# EAGLE design ZX_Kempston (EAGLE 6.5.0)
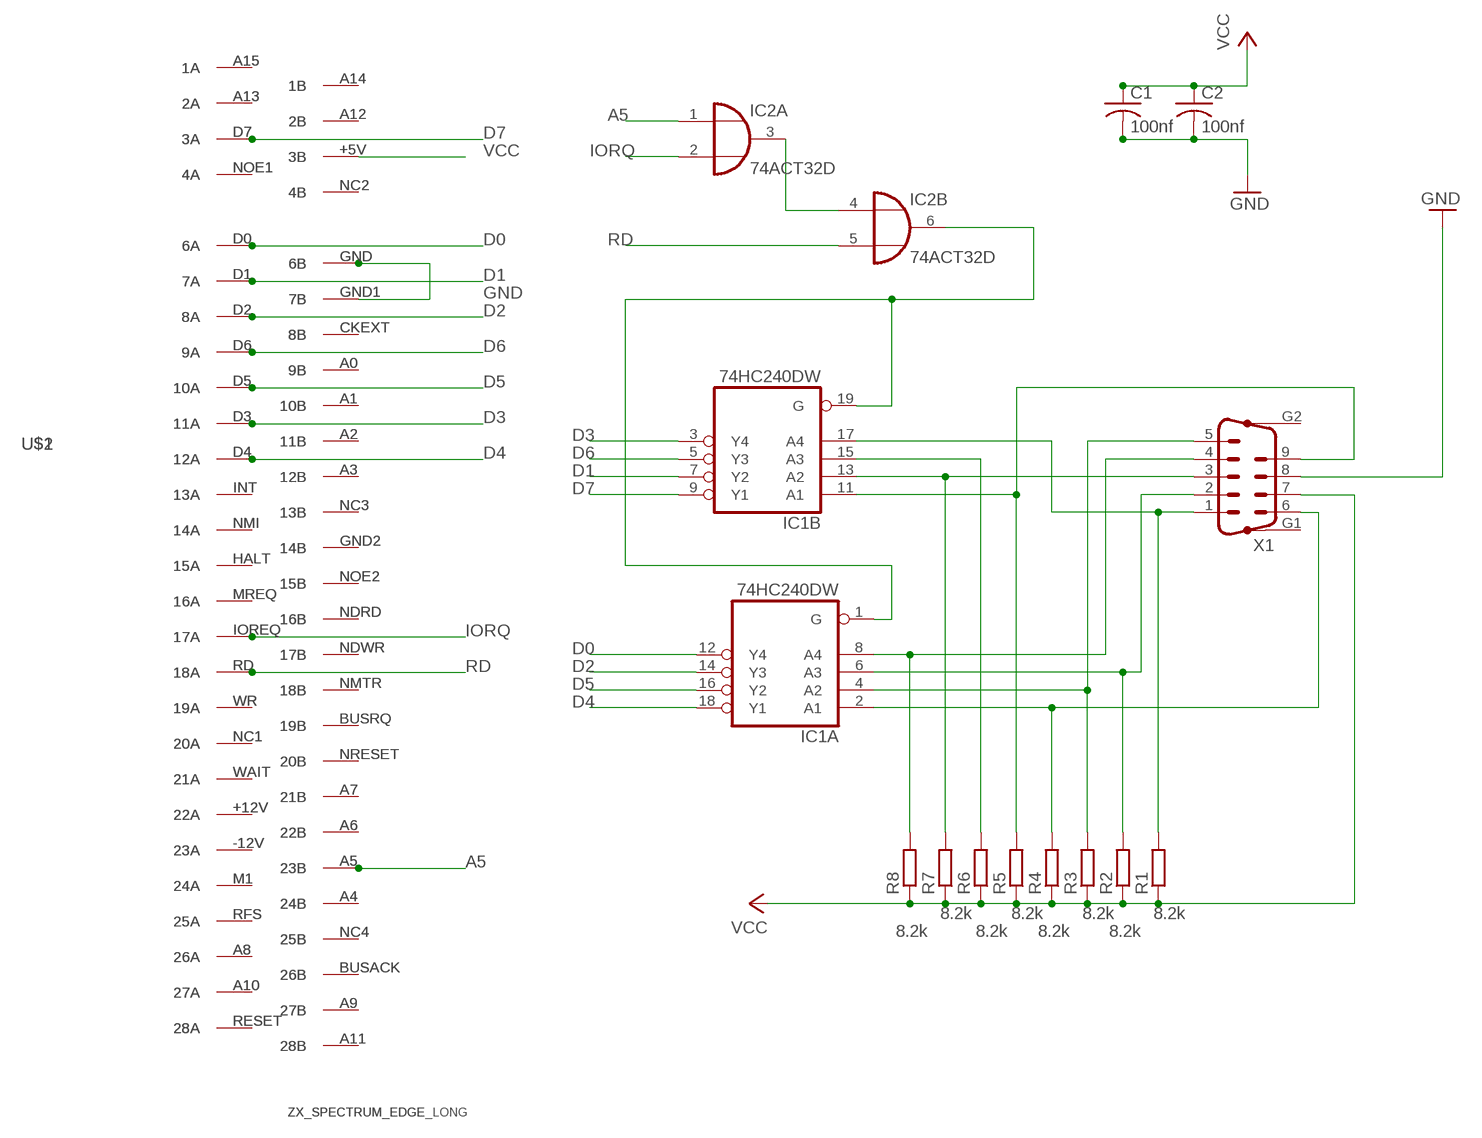
[diagram p0: schematic, sheet 1]

## Parts
C1  100nf  C-USC0805  [C0805]
C2  100nf  C-USC0805  [C0805]
IC1  74HC240DW  [SO20W]
IC2  74ACT32D  [SO14]
R1  8.2k  R-EU_M0805  [M0805]
R2  8.2k  R-EU_M0805  [M0805]
R3  8.2k  R-EU_M0805  [M0805]
R4  8.2k  R-EU_M0805  [M0805]
R5  8.2k  R-EU_M0805  [M0805]
R6  8.2k  R-EU_M0805  [M0805]
R7  8.2k  R-EU_M0805  [M0805]
R8  8.2k  R-EU_M0805  [M0805]
U$1  ZX_SPECTRUM_EDGE  [2X28_EDGE_2.54]
U$2  ZX_SPECTRUM_EDGE_LONG  [2X28_EDGE_LONG]
X1  M09VP  [M09VP]

## Nets
A5: IC2.1(A:I0) U$1.A5(23B) U$2.A5(23B)
D0: IC1.12(A:Y4) U$1.D0(6A) U$2.D0(6A)
D1: IC1.7(B:Y2) U$1.D1(7A) U$2.D1(7A)
D2: IC1.14(A:Y3) U$1.D2(8A) U$2.D2(8A)
D3: IC1.3(B:Y4) U$1.D3(11A) U$2.D3(11A)
D4: IC1.18(A:Y1) U$1.D4(12A) U$2.D4(12A)
D5: IC1.16(A:Y2) U$1.D5(10A) U$2.D5(10A)
D6: IC1.5(B:Y3) U$1.D6(9A) U$2.D6(9A)
D7: IC1.9(B:Y1) U$1.D7(3A) U$2.D7(3A)
GND [GND]: C1.2 C2.2 U$1.GND1(7B) U$1.GND(6B) U$2.GND1(7B) U$2.GND(6B) X1.8
IORQ: IC2.2(A:I1) U$1.IOREQ(17A) U$2.IOREQ(17A)
N$1: U$1.RESET(28A) U$2.RESET(28A)
N$2: U$1.A9(27B) U$2.A9(27B)
N$3: U$1.A10(27A) U$2.A10(27A)
N$4: U$1.BUSACK(26B) U$2.BUSACK(26B)
N$5: U$1.A8(26A) U$2.A8(26A)
N$6: U$1.NC4(25B) U$2.NC4(25B)
N$7: U$1.RFS(25A) U$2.RFS(25A)
N$8: U$1.A4(24B) U$2.A4(24B)
N$9: U$1.M1(24A) U$2.M1(24A)
N$11: U$1.-12V(23A) U$2.-12V(23A)
N$12: U$1.A6(22B) U$2.A6(22B)
N$13: U$1.+12V(22A) U$2.+12V(22A)
N$14: U$1.A7(21B) U$2.A7(21B)
N$15: U$1.WAIT(21A) U$2.WAIT(21A)
N$16: U$1.NRESET(20B) U$2.NRESET(20B)
N$17: U$1.NC1(20A) U$2.NC1(20A)
N$18: U$1.BUSRQ(19B) U$2.BUSRQ(19B)
N$19: U$1.WR(19A) U$2.WR(19A)
N$20: U$1.NMTR(18B) U$2.NMTR(18B)
N$22: U$1.NDWR(17B) U$2.NDWR(17B)
N$24: U$1.NDRD(16B) U$2.NDRD(16B)
N$25: U$1.MREQ(16A) U$2.MREQ(16A)
N$26: U$1.NOE2(15B) U$2.NOE2(15B)
N$27: U$1.HALT(15A) U$2.HALT(15A)
N$28: U$1.GND2(14B) U$2.GND2(14B)
N$29: U$1.NMI(14A) U$2.NMI(14A)
N$30: U$1.NC3(13B) U$2.NC3(13B)
N$31: U$1.INT(13A) U$2.INT(13A)
N$32: U$1.A3(12B) U$2.A3(12B)
N$34: U$1.A2(11B) U$2.A2(11B)
N$36: U$1.A1(10B) U$2.A1(10B)
N$38: U$1.A0(9B) U$2.A0(9B)
N$40: U$1.CKEXT(8B) U$2.CKEXT(8B)
N$46: U$1.NC2(4B) U$2.NC2(4B)
N$47: U$1.NOE1(4A) U$2.NOE1(4A)
N$50: U$1.A12(2B) U$2.A12(2B)
N$51: U$1.A13(2A) U$2.A13(2A)
N$52: U$1.A14(1B) U$2.A14(1B)
N$53: U$1.A15(1A) U$2.A15(1A)
N$54: U$1.A11(28B) U$2.A11(28B)
N$55: IC1.17(B:A4) R1.2 X1.1
N$56: IC1.6(A:A3) R2.2 X1.2
N$57: IC1.1(A:G) IC1.19(B:G) IC2.6(B:O)
N$58: IC2.3(A:O) IC2.4(B:I0)
N$59: IC1.13(B:A2) R7.2 X1.3
N$60: IC1.8(A:A4) R8.2 X1.4
N$61: IC1.4(A:A2) R3.2 X1.5
N$62: IC1.2(A:A1) R4.2 X1.6
N$64: IC1.15(B:A3) R6.2
N$65: IC1.11(B:A1) R5.2 X1.9
RD: IC2.5(B:I1) U$1.RD(18A) U$2.RD(18A)
VCC [VCC]: C1.1 C2.1 R1.1 R2.1 R3.1 R4.1 R5.1 R6.1 R7.1 R8.1 U$1.+5V(3B) U$2.+5V(3B) X1.7
Unconnected: IC2.8(C:O) IC2.9(C:I0) IC2.10(C:I1) IC2.11(D:O) IC2.12(D:I0) IC2.13(D:I1) X1.G1 X1.G2

## Power pins joined to a net without a drawn wire
GND: IC1.10(P:GND) IC2.7(P:GND)
VCC: IC1.20(P:VCC) IC2.14(P:VCC)

## Library data of the parts
C1 C2 = adafruit:C-US: CAPACITOR, American symbol
IC1 = 74xx-eu:74*240: Octal BUFFER and LINE DRIVER, 3-state
IC2 = 74xx-eu:74*32: Quad 2-input OR gate
R1-R8 = rcl:R-EU_: RESISTOR, European symbol
U$1 = 8Bit_Parts:ZX_SPECTRUM_EDGE: +2a/+3 edge connector
U$2 = 8Bit_Parts:ZX_SPECTRUM_EDGE_LONG: +2a/+3 edge connector
X1 = con-subd:M09VP: SUB-D; OC_FARNELL: unknown; OC_NEWARK: unknown

## Net classes
1 GND: width 0.457 mm
2 VCC: width 0.457 mm

## Board
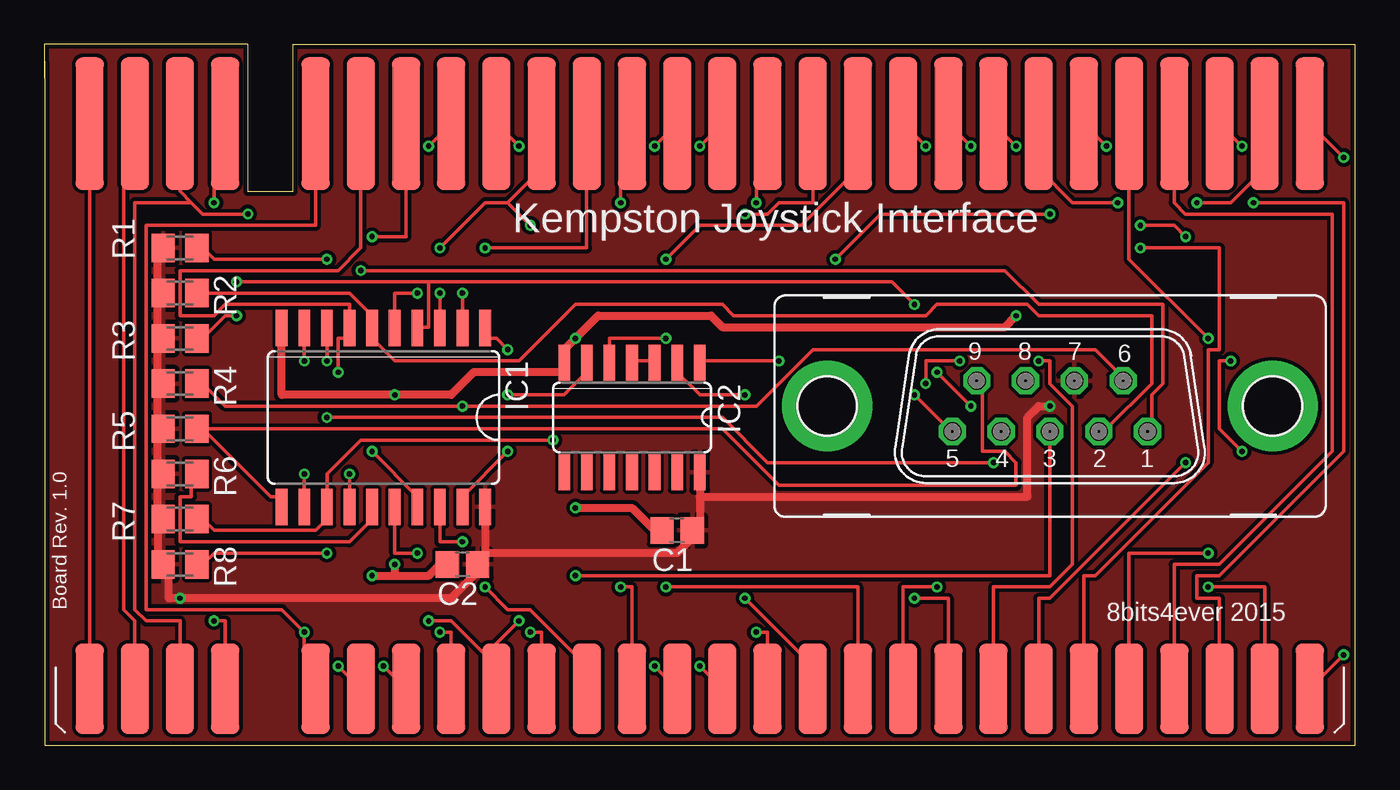
[diagram p1: board, top side]
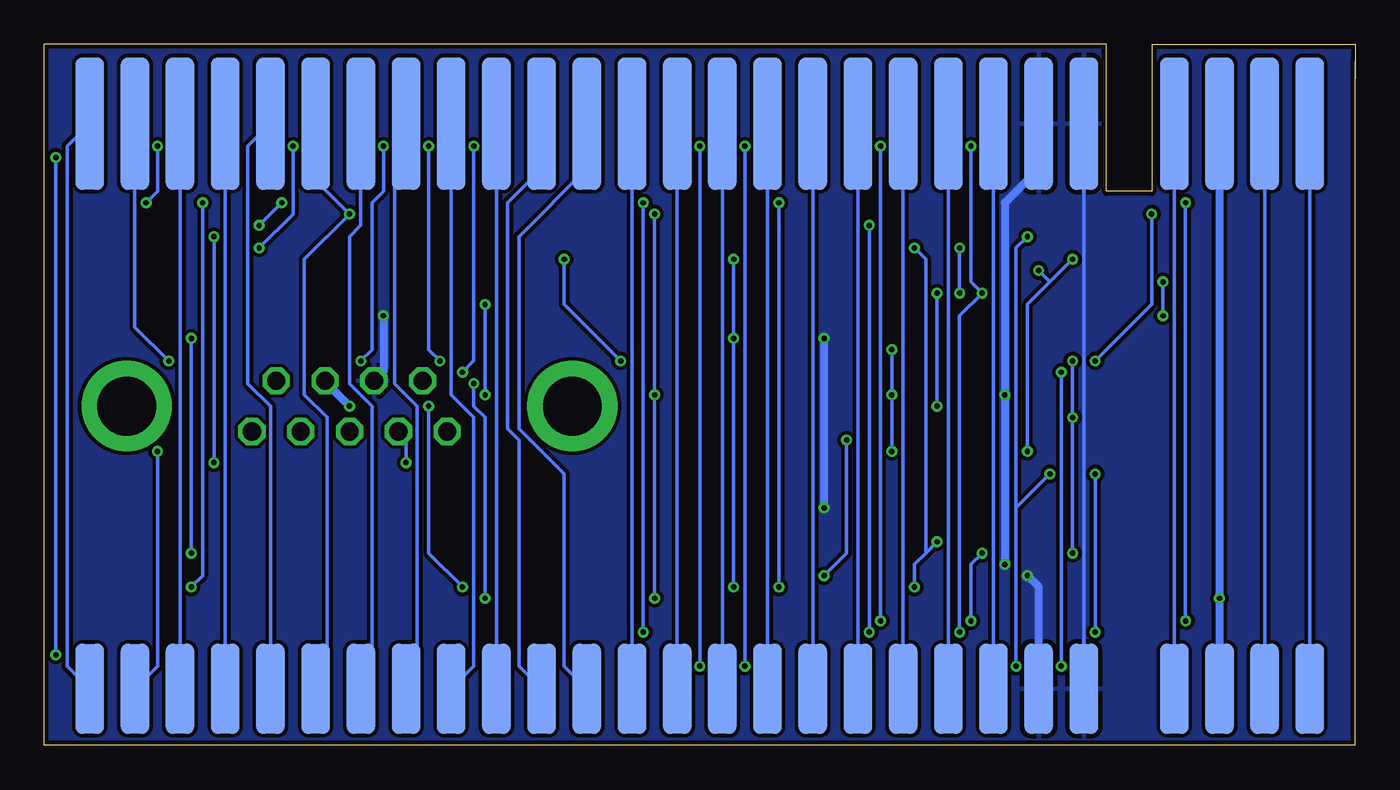
[diagram p2: board, bottom side, seen from below]

Size 73.66 x 39.37 mm. Coordinates in mm from the lower left corner, seen from the top.
Outline: 0.01,38.41 0.01,0 73.66,0 73.66,39.37 13.97,39.37 13.97,31.11 11.43,31.11 11.43,39.37 0,39.37 0,37.46
Copper layers (1*16): Top 0.035mm / dielectric 1.5mm / Bottom 0.035mm
Design rules "SeeedStudio_2layer_DRU_no_angle_20140221 *": minimum track width 8mil, minimum drill 12mil, track to track 8mil, track to pad 6mil, pad to pad 6mil, via to via 6mil, smd to smd 0mil, copper to edge 10mil, drill to drill 10mil, minimum pad ring 10mil, minimum via ring 6mil, stop-mask expansion 2mil, vias tented up to drill 100mil, thermal gap 10mil

### Footprints (pad centres in the part's own frame; a part is rotated, then mirrored left to right if it is on the bottom)
C0805 = smd 1.3 x 1.5: 1 -0.85,0; 2 0.85,0
SO20W = smd 0.66 x 2.032: 1 -5.715,-5.029; 2 -4.445,-5.029; 3 -3.175,-5.029; 4 -1.905,-5.029; 5 -0.635,-5.029; 6 0.635,-5.029; 7 1.905,-5.029; 8 3.175,-5.029; 9 4.445,-5.029; 10 5.715,-5.029; 11 5.715,5.029; 12 4.445,5.029; 13 3.175,5.029; 14 1.905,5.029; 15 0.635,5.029; 16 -0.635,5.029; 17 -1.905,5.029; 18 -3.175,5.029; 19 -4.445,5.029; 20 -5.715,5.029
SO14 = smd 0.66 x 2.032: 1 -3.81,-3.073; 2 -2.54,-3.073; 3 -1.27,-3.073; 4 0,-3.073; 5 1.27,-3.073; 6 2.54,-3.073; 7 3.81,-3.073; 8 3.81,3.073; 9 2.54,3.073; 10 1.27,3.073; 11 0,3.073; 12 -1.27,3.073; 13 -2.54,3.073; 14 -3.81,3.073
M0805 = smd 1.3 x 1.6: 1 -0.95,0; 2 0.95,0
2X28_EDGE_2.54 = smd 1.6 x 5.08 bottom: +5V -29.21,1.27; A0 -13.97,1.27; A1 -11.43,1.27; A2 -8.89,1.27; A3 -6.35,1.27; A4 24.13,1.27; A5 21.59,1.27; A6 19.05,1.27; A7 16.51,1.27; A9 31.75,1.27; A11 34.29,1.27; A12 -31.75,1.27; A14 -34.29,1.27; BUSACK 29.21,1.27; BUSRQ 11.43,1.27; CKEXT -16.51,1.27; GND -21.59,1.27; GND1 -19.05,1.27; GND2 -1.27,1.27; NC2 -26.67,1.27; NC3 -3.81,1.27; NC4 26.67,1.27; NDRD 3.81,1.27; NDWR 6.35,1.27; NMTR 8.89,1.27; NOE2 1.27,1.27; NRESET 13.97,1.27 | smd 1.6 x 5.08: +12V 19.05,1.27; -12V 21.59,1.27; A8 29.21,1.27; A10 31.75,1.27; A13 -31.75,1.27; A15 -34.29,1.27; D0 -21.59,1.27; D1 -19.05,1.27; D2 -16.51,1.27; D3 -8.89,1.27; D4 -6.35,1.27; D5 -11.43,1.27; D6 -13.97,1.27; D7 -29.21,1.27; HALT 1.27,1.27; INT -3.81,1.27; IOREQ 6.35,1.27; M1 24.13,1.27; MREQ 3.81,1.27; NC1 13.97,1.27; NMI -1.27,1.27; NOE1 -26.67,1.27; RD 8.89,1.27; RESET 34.29,1.27; RFS 26.67,1.27; WAIT 16.51,1.27; WR 11.43,1.27
2X28_EDGE_LONG = smd 1.6 x 7.452 bottom: +5V -30.48,0; A0 -15.24,0; A1 -12.7,0; A2 -10.16,0; A3 -7.62,0; A4 22.86,0; A5 20.32,0; A6 17.78,0; A7 15.24,0; A9 30.48,0; A11 33.02,0; A12 -33.02,0; A14 -35.56,0; BUSACK 27.94,0; BUSRQ 10.16,0; CKEXT -17.78,0; GND -22.86,0; GND1 -20.32,0; GND2 -2.54,0; NC2 -27.94,0; NC3 -5.08,0; NC4 25.4,0; NDRD 2.54,0; NDWR 5.08,0; NMTR 7.62,0; NOE2 0,0; NRESET 12.7,0 | smd 1.6 x 7.452: +12V 17.78,0; -12V 20.32,0; A8 27.94,0; A10 30.48,0; A13 -33.02,0; A15 -35.56,0; D0 -22.86,0; D1 -20.32,0; D2 -17.78,0; D3 -10.16,0; D4 -7.62,0; D5 -12.7,0; D6 -15.24,0; D7 -30.48,0; HALT 0,0; INT -5.08,0; IOREQ 5.08,0; M1 22.86,0; MREQ 2.54,0; NC1 12.7,0; NMI -2.54,0; NOE1 -27.94,0; RD 7.62,0; RESET 33.02,0; RFS 25.4,0; WAIT 15.24,0; WR 10.16,0
M09VP = drill 1.016 octagon: 1 -5.486,1.422; 2 -2.743,1.422; 3 0,1.422; 4 2.743,1.422; 5 5.486,1.422; 6 -4.115,-1.422; 7 -1.372,-1.422; 8 1.372,-1.422; 9 4.115,-1.422 | drill 3.302 pad 5.08: G1 -12.522,0; G2 12.522,0

### Placement (x,y rotation side)
C1  35.56,12.06 180 top
C2  23.49,10.16 180 top
IC1  19.05,18.42 180 top
IC2  33.02,18.42 180 top
R1  7.62,27.94 0 top
R2  7.62,25.4 0 top
R3  7.62,22.86 0 top
R4  7.62,20.32 0 top
R5  7.62,17.78 0 top
R6  7.62,15.24 0 top
R7  7.62,12.7 0 top
R8  7.62,10.16 0 top
U$1  36.83,1.9 0 top
U$2  38.1,34.92 0 top
X1  56.52,19.05 180 top

### Tracks (layer width: path | path; a pad name or v marks a point on that pad's centre or on a via)
A5  (via drill 0.3)
  Top 0.203: v41.27,21.59 36.83,21.59 IC2.1 | v44.45,27.3 46.99,29.85 v56.52,29.85
  Bottom 0.203: v41.27,21.59 44.45,24.77 v44.45,27.3 | U$2.A5 58.42,31.75 v56.52,29.85 59.05,27.3 59.05,19.69 57.78,18.42 57.78,3.81 U$1.A5
D0  (via drill 0.3)
  Top 0.203: v14.61,15.24 IC1.12 | U$1.D0 14.61,3.18 v14.61,6.35 13.34,7.62 5.71,7.62 5.71,29.21 15.24,29.21 U$2.D0
  Bottom 0.203: v14.61,6.35 v14.61,15.24
D1  (via drill 0.3)
  Top 0.203: U$2.D1 17.78,27.94 16.51,26.67 7.62,26.67 7.62,24.13 9.53,24.13 10.16,24.77 17.14,24.77 IC1.7 17.14,22.86 16.51,22.86 v16.51,20.96 | v16.51,4.45 U$1.D1
  Bottom 0.203: v16.51,20.96 v16.51,4.45
D2  (via drill 0.3)
  Top 0.203: v17.14,15.24 IC1.14 | U$1.D2 v19.05,4.45 | U$2.D2 20.32,28.57 v18.41,28.57
  Bottom 0.203: 19.05,13.33 v17.14,15.24 | v19.05,4.45 19.05,13.33 | v18.41,28.57 19.05,27.94 19.05,13.33
D3  (via drill 0.3)
  Top 0.203: v22.22,25.4 IC1.3 | v22.22,27.94 24.77,30.48 26.04,30.48 | 26.04,30.48 27.94,32.38 U$2.D3 | U$1.D3 27.94,6.35 v27.3,6.35 | 26.04,30.48 v27.3,29.21
  Bottom 0.203: v22.22,27.94 v22.22,25.4 | v27.3,29.21 v27.3,6.35
D4  (via drill 0.3)
  Top 0.203: IC1.18 22.22,11.43 v23.49,11.43 | v24.77,8.89 26.04,7.62 27.3,7.62 30.48,4.45 U$1.D4 | U$2.D4 30.48,27.94 v24.77,27.94
  Bottom 0.203: 24.13,10.79 24.77,10.16 v24.77,8.89 | 24.13,10.79 v23.49,11.43 | v24.77,27.94 24.13,27.3 24.13,10.79
D5  (via drill 0.3)
  Top 0.203: IC1.16 19.68,10.79 v20.95,10.79 | v21.59,6.98 22.86,6.98 24.77,5.08 | 24.77,5.08 25.4,4.45 U$1.D5 24.77,5.08 | v26.67,33.66 U$2.D5 | 24.77,5.08 v26.67,6.98
  Bottom 0.203: v20.95,10.79 21.59,10.16 v21.59,6.98 | v26.67,6.98 v26.67,33.66
D6  (via drill 0.3)
  Top 0.203: IC1.5 19.68,25.4 v20.95,25.4 | U$2.D6 v21.59,33.66 | U$1.D6 22.86,6.35 v22.22,6.35
  Bottom 0.203: v21.59,33.66 21.59,26.04 v20.95,25.4 22.22,24.13 v22.22,6.35
D7  (via drill 0.3)
  Top 0.203: v14.61,21.59 IC1.9 | v11.43,29.85 8.89,29.85 8.26,30.48 | 8.26,30.48 7.62,31.11 U$2.D7 | U$1.D7 7.62,6.98 5.71,6.98 5.08,7.62 5.08,30.48 8.26,30.48
  Bottom 0.203: v14.61,21.59 11.43,24.77 v11.43,29.85
GND  (via drill 0.3)
  Top 0.457: v18.41,9.53 19.68,9.53 | 19.68,9.53 21.59,9.53 22.22,10.16 C2.2 | v19.68,10.16 19.68,9.53 | v29.84,13.33 33.02,13.33 34.29,12.06 C1.2 | IC1.10 13.34,19.69 v19.68,19.69 22.86,19.69 24.13,20.96 29.21,20.96 IC2.7 29.21,22.23 v29.84,22.86 31.12,24.13 37.46,24.13 38.1,23.5 53.98,23.5 v54.61,24.13
  Bottom 0.203: U$2.GND U$1.GND
  Bottom 0.457: v18.41,9.53 17.78,8.89 U$1.GND1 | v19.68,10.16 v19.68,19.69 19.68,30.48 17.78,32.38 U$2.GND1 | v29.84,22.86 v29.84,13.33 | v54.61,24.13 54.61,20.96 X1.8
  pour Bottom: -1.27,40.64 -1.27,-1.91 75.56,-1.91 75.56,40.64
IORQ  (via drill 0.3)
  Top 0.203: v39.37,19.69 36.83,19.69 35.56,20.96 IC2.2 | v39.37,8.25 43.18,4.45 U$1.IOREQ | U$2.IOREQ 43.18,30.48 41.27,30.48 40.64,29.85 v39.37,29.85
  Bottom 0.203: v39.37,8.25 v39.37,19.69 v39.37,29.85
N$1  (via drill 0.3)
  Top 0.203: v73.03,5.08 U$1.RESET | U$2.RESET v73.03,33.02
  Bottom 0.203: v73.03,33.02 v73.03,5.08
N$2  (via drill 0.3)
  Top 0.203: v67.31,16.51 66.04,17.78 66.04,21.59 v66.67,21.59
  Bottom 0.203: U$1.A9 67.31,4.45 v67.31,16.51 | v66.67,21.59 68.58,23.5 U$2.A9
N$3  (via drill 0.3)
  Top 0.203: U$1.A10 68.58,8.89 v65.41,8.89 | v64.77,30.48 66.67,30.48 68.58,32.38 U$2.A10
  Bottom 0.203: v65.41,8.89 64.77,9.53 v64.77,30.48
N$4
  Bottom 0.203: U$2.BUSACK U$1.BUSACK
N$5  (via drill 0.3)
  Top 0.203: U$1.A8 66.04,8.25 64.77,8.25 64.77,9.53 66.04,9.53 73.03,16.51 73.03,30.48 v67.94,30.48 | U$2.A8 v67.31,33.66
  Bottom 0.203: v67.94,30.48 67.31,31.11 v67.31,33.66
N$6
  Bottom 0.203: U$2.NC4 U$1.NC4
N$7
  Top 0.203: U$1.RFS 63.5,10.16 66.04,10.16 72.39,16.51 72.39,29.85 64.14,29.85 63.5,30.48 U$2.RFS
N$8
  Bottom 0.203: U$1.A4 60.96,19.05 62.23,20.32 62.23,33.66 U$2.A4
N$9  (via drill 0.3)
  Top 0.203: U$1.M1 60.96,10.79 v65.41,10.79 | v65.41,22.86 60.96,27.3 U$2.M1
  Bottom 0.203: v65.41,22.86 v65.41,10.79
N$11  (via drill 0.3)
  Top 0.203: U$1.-12V 58.42,9.53 59.05,9.53 65.41,15.87 65.41,22.23 66.04,22.23 66.04,27.94 v61.59,27.94 | U$2.-12V v59.69,33.66
  Bottom 0.203: v61.59,27.94 59.69,29.85 v59.69,33.66
N$12
  Bottom 0.203: U$1.A6 55.24,3.81 55.24,19.05 56.52,20.32 56.52,28.57 55.88,29.21 U$2.A6
N$13  (via drill 0.3)
  Top 0.203: U$1.+12V 55.88,8.25 56.52,8.25 v64.14,15.87 | v64.14,28.57 63.5,29.21 v61.59,29.21 | v60.32,30.48 57.78,30.48 55.88,32.38 U$2.+12V
  Bottom 0.203: v64.14,28.57 v64.14,15.87 | v60.32,30.48 v61.59,29.21
N$14
  Bottom 0.203: U$1.A7 52.7,3.81 52.7,19.05 53.98,20.32 53.98,34.29 U$2.A7
N$15  (via drill 0.3)
  Top 0.203: U$1.WAIT 53.34,8.89 56.52,8.89 57.78,10.16 57.78,19.05 56.52,20.32 56.52,21.59 v55.88,21.59 | U$2.WAIT v54.61,33.66
  Bottom 0.203: v55.88,21.59 55.24,22.23 55.24,30.48 54.61,31.11 v54.61,33.66
N$16
  Bottom 0.203: U$1.NRESET 49.53,4.45 49.53,18.42 50.8,19.69 U$2.NRESET
N$17  (via drill 0.3)
  Top 0.203: U$1.NC1 50.8,8.25 v48.89,8.25 | v49.53,20.32 49.53,21.59 v51.44,21.59 | U$2.NC1 v52.07,33.66
  Bottom 0.203: v48.89,8.25 48.89,18.42 49.53,19.05 v49.53,20.32 | v51.44,21.59 52.07,22.23 v52.07,33.66
N$18
  Bottom 0.203: U$2.BUSRQ U$1.BUSRQ
N$19  (via drill 0.3)
  Top 0.203: U$1.WR 48.26,8.89 v50.16,8.89 | v50.16,20.96 v52.07,19.05 | U$2.WR v49.53,33.66
  Bottom 0.203: v50.16,8.89 52.07,10.79 v52.07,19.05 | v50.16,20.96 49.53,21.59 v49.53,33.66
N$20
  Bottom 0.203: U$1.NMTR 46.99,4.45 46.99,17.14 47.62,17.78 47.62,30.48 45.72,32.38 U$2.NMTR
N$22
  Bottom 0.203: U$1.NDWR 44.45,4.45 44.45,15.24 46.99,17.78 46.99,28.57 43.18,32.38 U$2.NDWR
N$24
  Bottom 0.203: U$2.NDRD U$1.NDRD
N$25  (via drill 0.3)
  Top 0.203: U$1.MREQ 40.64,6.35 v40,6.35 | v40,30.48 40,34.92 U$2.MREQ
  Bottom 0.203: v40,30.48 v40,6.35
N$26
  Bottom 0.203: U$2.NOE2 U$1.NOE2
N$27  (via drill 0.3)
  Top 0.203: v36.83,4.45 U$1.HALT | U$2.HALT v36.83,33.66
  Bottom 0.203: v36.83,33.66 v36.83,4.45
N$28
  Bottom 0.203: U$2.GND2 U$1.GND2
N$29  (via drill 0.3)
  Top 0.203: v34.29,4.45 U$1.NMI | U$2.NMI v34.29,33.66
  Bottom 0.203: v34.29,33.66 v34.29,4.45
N$30
  Bottom 0.203: U$2.NC3 U$1.NC3
N$31  (via drill 0.3)
  Top 0.203: U$1.INT 33.02,8.89 v32.38,8.89 | v32.38,30.48 32.38,34.92 U$2.INT
  Bottom 0.203: v32.38,30.48 v32.38,8.89
N$32
  Bottom 0.203: U$2.A3 U$1.A3
N$34
  Bottom 0.203: U$2.A2 U$1.A2
N$36
  Bottom 0.203: U$2.A1 U$1.A1
N$38
  Bottom 0.203: U$2.A0 U$1.A0
N$40
  Bottom 0.203: U$2.CKEXT U$1.CKEXT
N$46
  Bottom 0.203: U$2.NC2 U$1.NC2
N$47  (via drill 0.3)
  Top 0.203: U$1.NOE1 10.16,6.98 v9.53,6.98 | v9.53,30.48 9.53,34.92 U$2.NOE1
  Bottom 0.203: v9.53,30.48 v9.53,6.98
N$50
  Bottom 0.203: U$2.A12 U$1.A12
N$51
  Top 0.203: U$1.A13 5.08,6.98 4.44,7.62 4.44,34.92 U$2.A13
N$52
  Bottom 0.203: U$2.A14 U$1.A14
N$53
  Top 0.203: U$2.A15 U$1.A15
N$54
  Bottom 0.203: U$1.A11 72.39,4.45 72.39,33.66 U$2.A11
N$55  (via drill 0.3)
  Top 0.203: v15.88,27.3 9.53,27.3 8.89,27.94 R1.2 | v18.41,16.51 20.95,13.97 IC1.17 | v17.78,26.67 53.98,26.67 55.88,24.77 62.86,24.77 62.86,20.32 62.23,19.69 62.23,17.78 X1.1
  Bottom 0.203: 17.14,26.04 18.41,24.77 v18.41,16.51 | 17.14,26.04 v15.88,27.3 | 17.14,26.04 v17.78,26.67
N$56
  Top 0.203: R2.2 17.14,25.4 18.41,24.13 IC1.6 18.41,22.86 19.68,21.59 26.67,21.59 29.84,24.77 38.1,24.77 38.73,24.13 49.53,24.13 50.16,24.77 55.24,24.77 55.88,24.13 62.23,24.13 62.23,20.32 59.69,17.78 X1.2
N$57  (via drill 0.3)
  Top 0.203: v26.04,16.51 23.49,13.97 IC1.19 | v26.04,22.23 25.4,22.86 24.77,22.86 IC1.1 | v26.04,19.69 29.21,19.69 30.48,20.96 IC2.6
  Bottom 0.203: v26.04,22.23 v26.04,19.69 v26.04,16.51
N$58
  Top 0.203: IC2.3 34.29,21.59 33.02,21.59 IC2.4
N$59  (via drill 0.3)
  Top 0.203: R7.2 8.89,12.7 9.53,12.06 15.24,12.06 15.88,12.7 IC1.13 15.88,15.24 17.78,17.14 v28.57,17.14 | X1.3 56.52,9.53 v29.84,9.53
  Bottom 0.203: v29.84,9.53 28.57,10.79 v28.57,17.14
N$60  (via drill 0.3)
  Top 0.203: v15.88,10.79 9.53,10.79 8.89,10.16 R8.2 | IC1.8 v15.88,21.59 | v53.34,15.87 40.64,15.87 38.1,18.42 v15.88,18.42
  Bottom 0.203: v15.88,21.59 v15.88,18.42 v15.88,10.79 | v53.34,15.87 53.34,17.14 X1.4
N$61  (via drill 0.3)
  Top 0.203: v10.79,24.13 10.16,24.13 8.89,22.86 R3.2 | 21.59,26.04 v10.79,26.04 | 21.59,26.04 21.59,23.5 20.95,23.5 IC1.4 | v48.89,19.69 50.8,17.78 X1.5 | v48.89,24.77 47.62,26.04 21.59,26.04
  Bottom 0.203: v10.79,26.04 v10.79,24.13 | v48.89,24.77 v48.89,19.69
N$62  (via drill 0.3)
  Top 0.203: R4.2 8.89,20.32 10.16,19.05 v23.49,19.05 40,19.05 43.18,22.23 59.05,22.23 60.32,20.96 X1.6 | v23.49,25.4 IC1.2
  Bottom 0.203: v23.49,19.05 v23.49,25.4
N$64
  Top 0.203: IC1.15 18.41,12.7 17.14,11.43 7.62,11.43 7.62,13.97 8.26,13.97 8.26,15.24 R6.2
N$65
  Top 0.203: 8.89,17.78 12.7,13.97 13.34,13.97 IC1.11 | 8.89,17.78 38.1,17.78 41.27,14.6 54.61,14.6 54.61,15.87 53.98,16.51 52.7,16.51 52.7,20.32 X1.9 | 8.89,17.78 R5.2
RD  (via drill 0.3)
  Top 0.203: IC2.5 31.75,22.86 v34.92,22.86 | v34.92,27.3 36.83,29.21 42.55,29.21 45.72,32.38 U$2.RD | U$1.RD 45.72,8.89 v34.92,8.89
  Bottom 0.203: v34.92,27.3 v34.92,22.86 v34.92,8.89
VCC  (via drill 0.3)
  Top 0.457: 6.35,12.7 6.35,10.16 R8.1 6.99,10.16 6.99,8.25 v7.62,8.25 22.86,8.25 24.77,10.16 | 6.35,12.7 6.35,15.24 | 6.35,12.7 R7.1 | 6.35,15.24 6.35,17.78 | 6.35,15.24 R6.1 | 6.35,17.78 6.35,20.32 | 6.35,17.78 R5.1 | 6.35,20.32 6.35,22.86 | 6.35,20.32 R4.1 | 6.35,22.86 6.35,25.4 | 6.35,22.86 R3.1 | 6.35,25.4 6.35,27.94 R1.1 | 6.35,25.4 R2.1 | IC1.20 24.77,10.79 | 24.77,10.79 24.77,10.16 | IC2.14 36.83,13.97 | 36.83,13.97 36.83,12.06 | 24.77,10.79 35.56,10.79 36.83,12.06 | 24.77,10.79 C2.1 24.77,10.16 | 36.83,12.06 C1.1 | v56.52,19.05 55.88,19.05 55.24,18.42 55.24,13.97 36.83,13.97
  Bottom 0.457: U$2.+5V v7.62,8.25 U$1.+5V | v56.52,19.05 57.78,20.32 X1.7
  pour Top: -1.91,41.91 -1.91,-3.17 76.2,-3.17 76.2,41.91

### Text on the board
tNames: Kempston Joystick Interface | Board Rev. 1.0 | 8bits4ever 2015